# EasyEDA Pro project New Project_2026-09-05_09-11-29.eprj, schematic Schematic3

## Sheets
1 主板: Board Name: 主板; Create Date: 2026-09-05; Page Name: 主板; Project Name: New Project_2026-09-05_09-11-29; Schematic Name: Schematic3; Update Date: 2026-09-07; Company: 嘉立创EDA; Page Size: A4; Version: V1.0
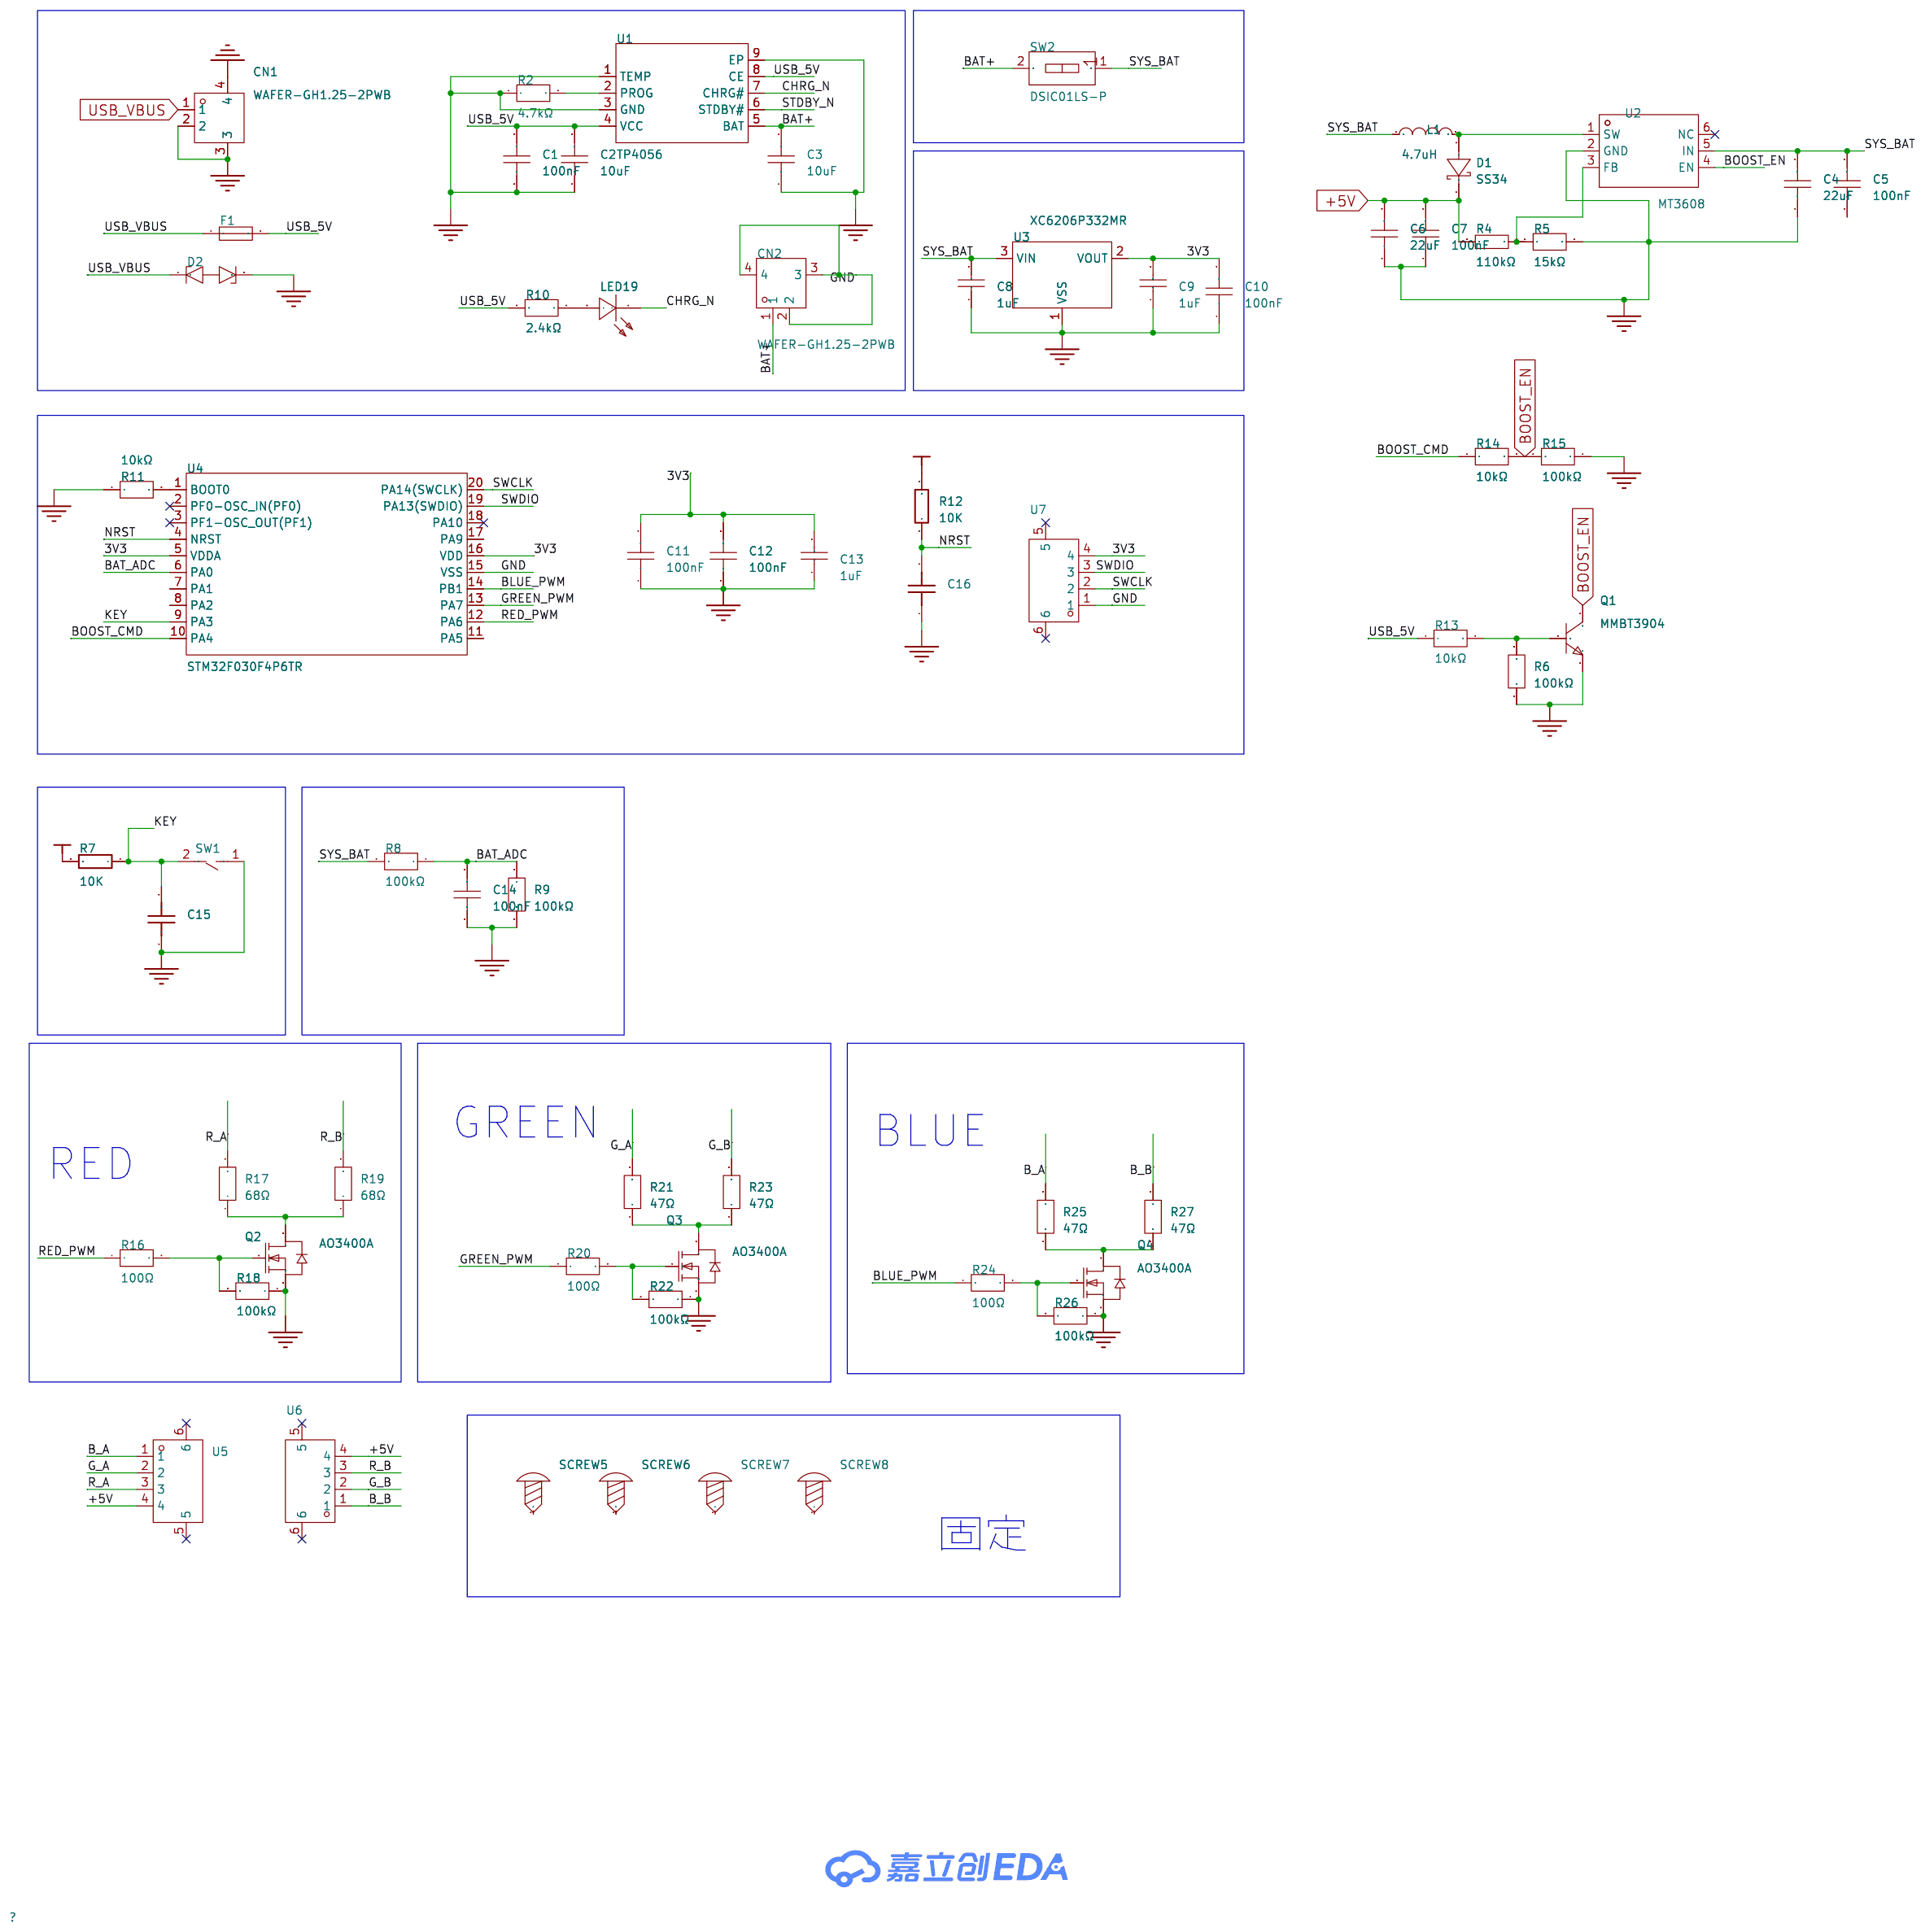
[diagram p1: 主板]
2 灯珠板: Page Name: 灯珠板; Update Date: 2026-09-05
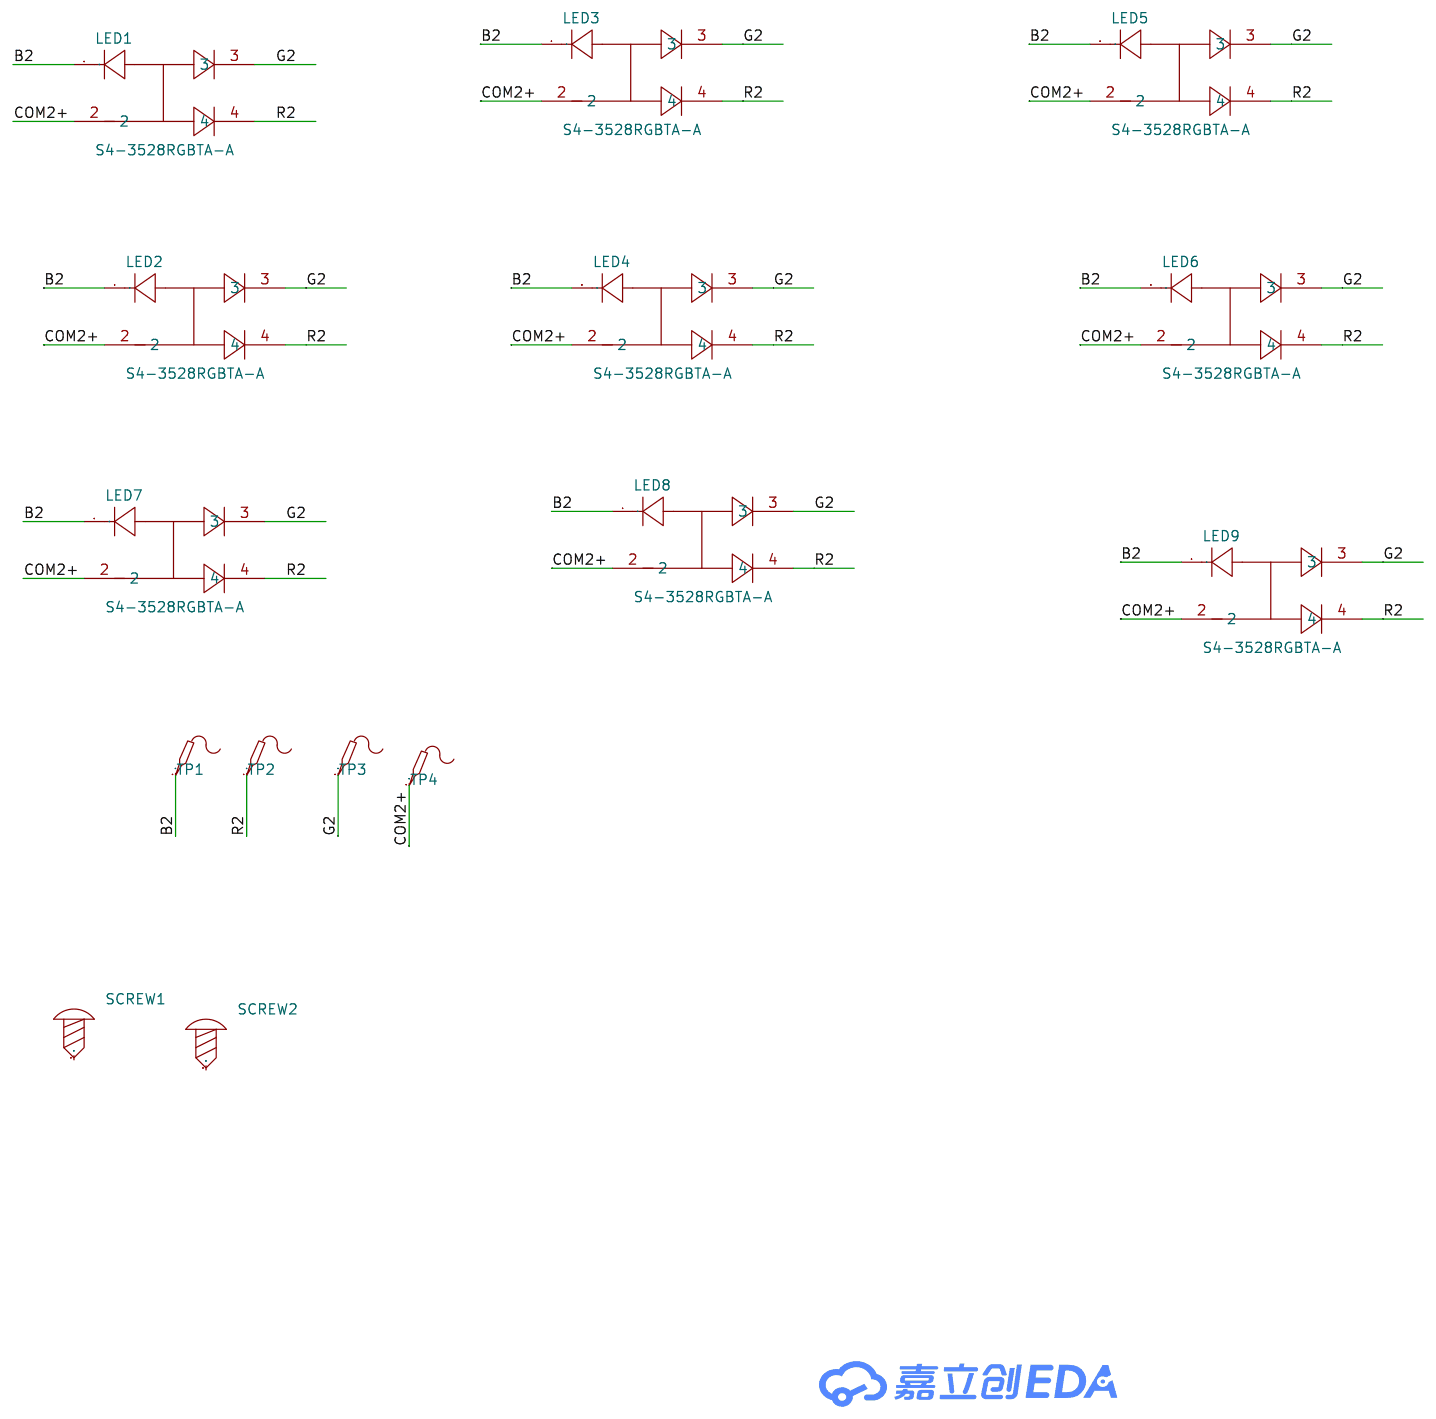
[diagram p2: 灯珠板]
3 灯珠板2: Page Name: 灯珠板2; Update Date: 2026-09-05
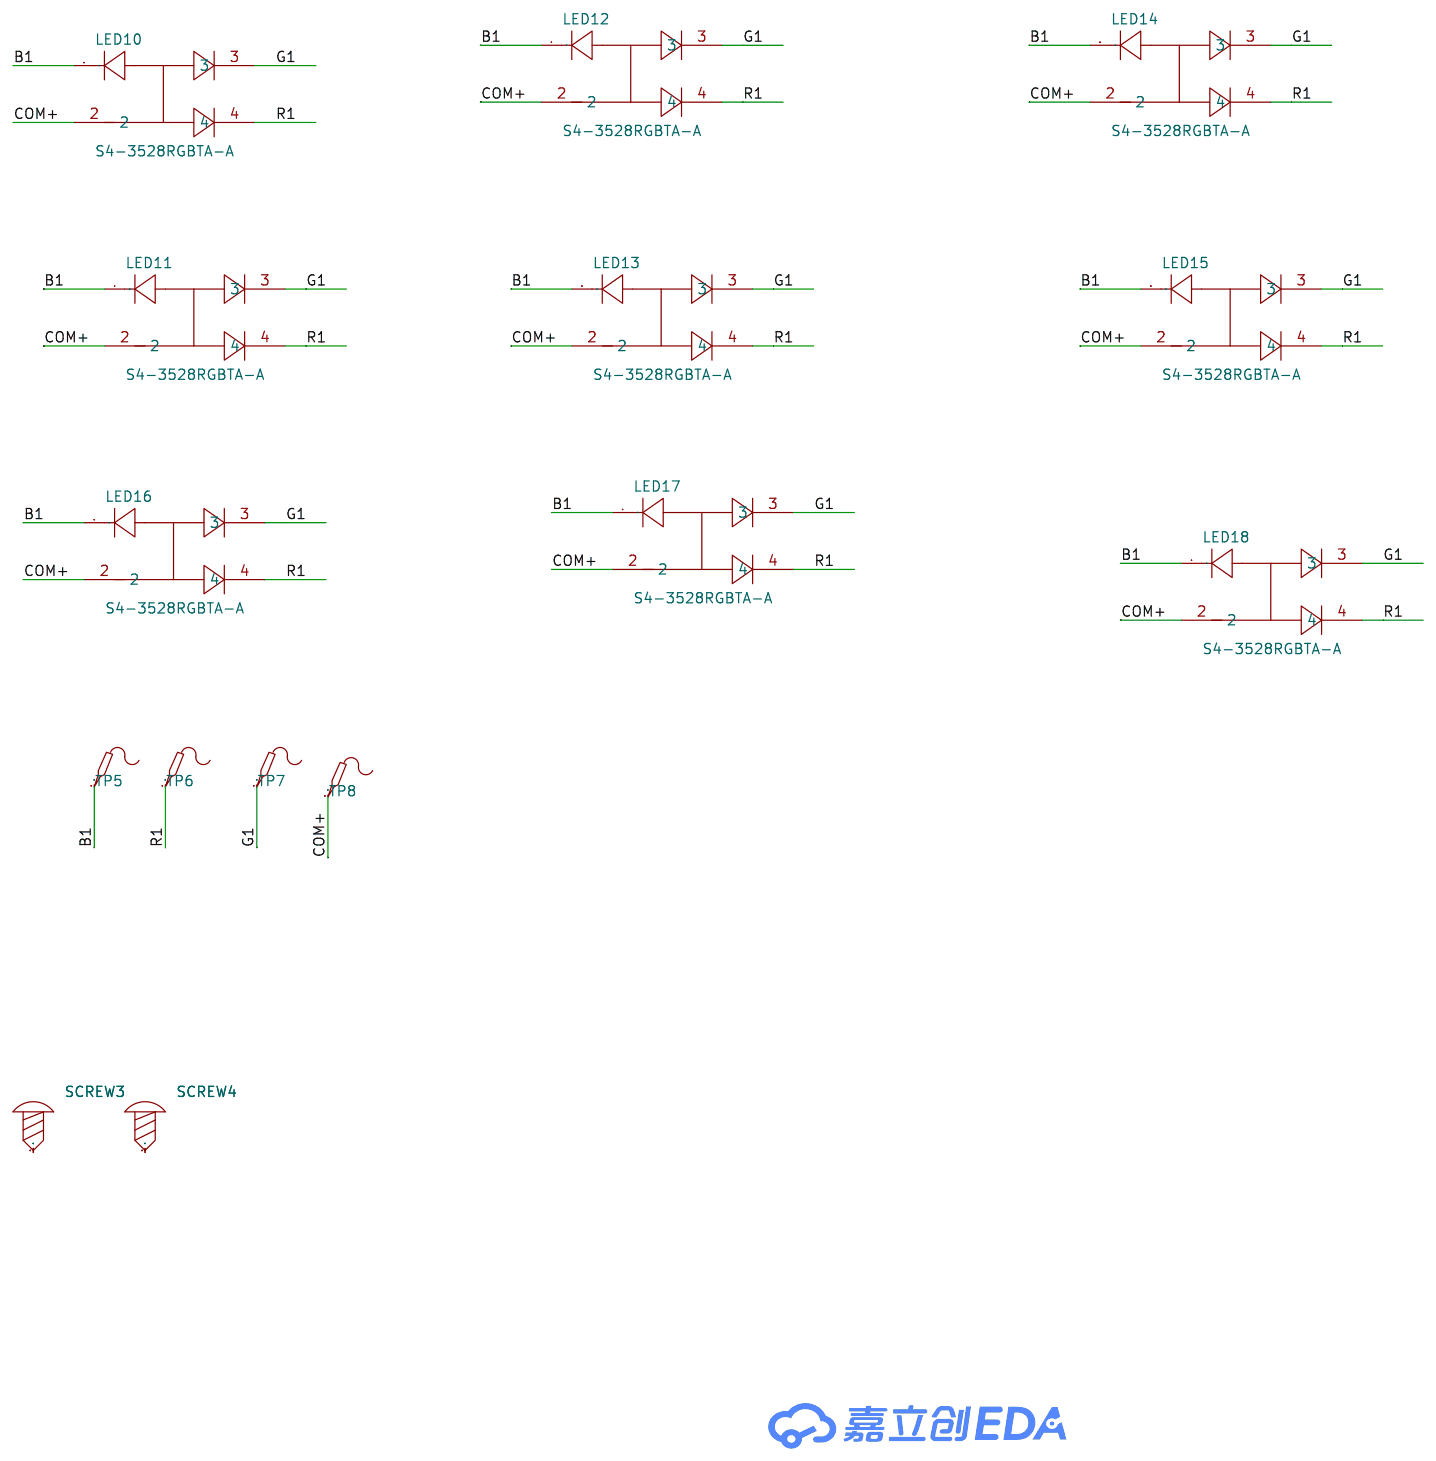
[diagram p3: 灯珠板2]

## Parts
sheet 主板
C1  100nF  [C0603]
C2  10uF  [C1206]
C3  10uF  [C1206]
C4  22uF  [C0805]
C5  100nF  [C0603]
C6  22uF  [C0805]
C7  100nF  [C0603]
C8  1uF  [C0603]
C9  1uF  [C0603]
C10  100nF  [C0603]
C11  100nF  [C0603]
C12  100nF  [C0603]
C13  1uF  [C0603]
C14  100nF  [C0603]
C15  100nF  [C0603]
C16  100nF  [C0603]
CN1  WAFER-GH1.25-2PWB  [CONN-TH_2P-P1.25_XUNPU_WAFER-GH1.25-2PWB]
CN2  WAFER-GH1.25-2PWB  [CONN-TH_2P-P1.25_XUNPU_WAFER-GH1.25-2PWB]
D1  SS34  [SMA_L4.3-W2.6-LS5.0-FD]
D2  PESD5V0S1BA,115  [SOD-323_L1.7-W1.3-LS2.5-BI]
F1  BSMD1206-200-6V  [F1206]
L1  4.7uH  [IND-SMD_L4.6-W4.1-A]
LED19  LTST-C190KSKT  [LED0603-RD]
Q1  MMBT3904  [SOT-23-3_L2.9-W1.3-P1.90-LS2.4-BR]
Q2  AO3400A  [SOT-23-3_L2.9-W1.3-P1.90-LS2.4-BR]
Q3  AO3400A  [SOT-23-3_L2.9-W1.3-P1.90-LS2.4-BR]
Q4  AO3400A  [SOT-23-3_L2.9-W1.3-P1.90-LS2.4-BR]
R2  4.7kΩ  [R0603]
R4  110kΩ  [R0603]
R5  15kΩ  [R0603]
R6  100kΩ  [R0603]
R7  10K  [R0603]
R8  100kΩ  [R0603]
R9  100kΩ  [R0603]
R10  2.4kΩ  [R0603]
R11  10kΩ  [R0603]
R12  10K  [R0603]
R13  10kΩ  [R0603]
R14  10kΩ  [R0603]
R15  100kΩ  [R0603]
R16  100Ω  [R0603]
R17  68Ω  [R1210]
R18  100kΩ  [R0603]
R19  68Ω  [R1210]
R20  100Ω  [R0603]
R21  47Ω  [R1210]
R22  100kΩ  [R0603]
R23  47Ω  [R1210]
R24  100Ω  [R0603]
R25  47Ω  [R1210]
R26  100kΩ  [R0603]
R27  47Ω  [R1210]
SCREW5  -  [M2螺丝]
SCREW6  -  [M2螺丝]
SCREW7  -  [M2螺丝]
SCREW8  -  [M2螺丝]
SW1  TSX06121-095B333DA-L2000  [SW-TH_L6.1-W6.1-P5.00]
SW2  DSIC01LS-P  [SW-SMD_2P-L3.5-W6.1-P2.54-LS9.8]
U1  TP4056  [ESOP-8_L4.9-W3.9-P1.27-LS6.0-BL-EP]
U2  MT3608  [SOT-23-6_L2.9-W1.6-P0.95-LS2.8-BL]
U3  XC6206P332MR  [SOT-23-3_L2.9-W1.3-P1.90-LS2.4-BR]
U4  STM32F030F4P6TR  [SOP-20_L6.5-W4.4-P0.65-LS6.4-BL]
U5  WAFER-GH1.25-4PWB  [CONN-SMD_4P-P1.25_XUNPU_WAFER-GH1.25-4PWB]
U6  WAFER-GH1.25-4PWB  [CONN-SMD_4P-P1.25_XUNPU_WAFER-GH1.25-4PWB]
U7  WAFER-GH1.25-4PWB  [CONN-SMD_4P-P1.25_XUNPU_WAFER-GH1.25-4PWB]
sheet 灯珠板2
LED10  S4-3528RGBTA-A  [LED-SMD_4P-L3.2-W2.8-LS3.5-TL-1]
LED11  S4-3528RGBTA-A  [LED-SMD_4P-L3.2-W2.8-LS3.5-TL-1]
LED12  S4-3528RGBTA-A  [LED-SMD_4P-L3.2-W2.8-LS3.5-TL-1]
LED13  S4-3528RGBTA-A  [LED-SMD_4P-L3.2-W2.8-LS3.5-TL-1]
LED14  S4-3528RGBTA-A  [LED-SMD_4P-L3.2-W2.8-LS3.5-TL-1]
LED15  S4-3528RGBTA-A  [LED-SMD_4P-L3.2-W2.8-LS3.5-TL-1]
LED16  S4-3528RGBTA-A  [LED-SMD_4P-L3.2-W2.8-LS3.5-TL-1]
LED17  S4-3528RGBTA-A  [LED-SMD_4P-L3.2-W2.8-LS3.5-TL-1]
LED18  S4-3528RGBTA-A  [LED-SMD_4P-L3.2-W2.8-LS3.5-TL-1]
SCREW3  -  [M2螺丝]
SCREW4  -  [M2螺丝]
TP5  -  [Test-Point-0.5mm]
TP6  -  [Test-Point-0.5mm]
TP7  -  [Test-Point-0.5mm]
TP8  -  [Test-Point-0.5mm]
sheet 灯珠板
LED1  S4-3528RGBTA-A  [LED-SMD_4P-L3.2-W2.8-LS3.5-TL-1]
LED2  S4-3528RGBTA-A  [LED-SMD_4P-L3.2-W2.8-LS3.5-TL-1]
LED3  S4-3528RGBTA-A  [LED-SMD_4P-L3.2-W2.8-LS3.5-TL-1]
LED4  S4-3528RGBTA-A  [LED-SMD_4P-L3.2-W2.8-LS3.5-TL-1]
LED5  S4-3528RGBTA-A  [LED-SMD_4P-L3.2-W2.8-LS3.5-TL-1]
LED6  S4-3528RGBTA-A  [LED-SMD_4P-L3.2-W2.8-LS3.5-TL-1]
LED7  S4-3528RGBTA-A  [LED-SMD_4P-L3.2-W2.8-LS3.5-TL-1]
LED8  S4-3528RGBTA-A  [LED-SMD_4P-L3.2-W2.8-LS3.5-TL-1]
LED9  S4-3528RGBTA-A  [LED-SMD_4P-L3.2-W2.8-LS3.5-TL-1]
SCREW1  -  [M2螺丝]
SCREW2  -  [M2螺丝]
TP1  -  [Test-Point-0.5mm]
TP2  -  [Test-Point-0.5mm]
TP3  -  [Test-Point-0.5mm]
TP4  -  [Test-Point-0.5mm]

## Library data of the parts
C1 C5 C7 C10-C12 C14 = FCC0603B104K500CT: LCSC Part Name: 100nF ±10% 50V; Supplier Part: C5137636; Manufacturer: FOJAN(富捷); Supplier Footprint: 0603; JLCPCB Part Class: 扩展库; Datasheet: https://item.szlcsc.com/datasheet/FCC0603B104K500CT/5747088.html; Supplier: LCSC; Tolerance: ±10%; Voltage Rating: 50V; Temperature Coefficient: X7R; Operating Temperature: -55℃~+125℃; supplier: LCSC; supplierId: C5137636
C2 C3 = HGC1206R5106K500NSPJ: LCSC Part Name: 10uF ±10% 50V; Supplier Part: C7432781; Manufacturer: Chinocera(华瓷); Supplier Footprint: 1206; JLCPCB Part Class: 扩展库; Datasheet: https://item.szlcsc.com/datasheet/HGC1206R5106K500NSPJ/8438263.html; Supplier: LCSC; Tolerance: ±10%; Voltage Rating: 50V; Temperature Coefficient: X5R; supplier: LCSC; supplierId: C7432781
C4 C6 = CGA0805X5R226M250MT: LCSC Part Name: 22uF ±20% 25V; Supplier Part: C6119899; Manufacturer: HRE(芯声); Supplier Footprint: 0805; JLCPCB Part Class: 扩展库; Datasheet: https://item.szlcsc.com/datasheet/CGA0805X5R226M250MT/7062605.html; Supplier: LCSC; Tolerance: ±20%; Voltage Rating: 25V; Temperature Coefficient: X5R; supplier: LCSC; supplierId: C6119899
C8 C9 C13 = CC0603KRX5R8BB105: LCSC Part Name: 1uF ±10% 25V; Supplier Part: C14664; Manufacturer: YAGEO(国巨); Supplier Footprint: 0603; JLCPCB Part Class: 扩展库; Datasheet: https://item.szlcsc.com/datasheet/CC0603KRX5R8BB105/15332.html; Supplier: LCSC; Tolerance: ±10%; Voltage Rating: 25V; Temperature Coefficient: X5R; supplier: LCSC; supplierId: C14664
C15 C16 = CAP_0603: Supplier Footprint: 0603
CN1 CN2 = WAFER-GH1.25-2PWB: LCSC Part Name: 1x2P 间距:1.25mm 卧贴 系列:GH; Supplier Part: C3029377; Manufacturer: XUNPU(讯普); Supplier Footprint: SMD,P=1.25mm,卧贴; JLCPCB Part Class: 扩展库; Datasheet: https://item.szlcsc.com/datasheet/WAFER-GH1.25-2PWB/3561389.html; Supplier: LCSC; Pins Structure: 1x2P; Pitch: 1.25mm; Mounting Type: 卧贴; Reference Series: GH; Number of Pins: 2P; Number of Rows: 1; Number of PINs Per Row: 2; Current Rating: 1A; Contact Material: 黄铜; Contact Plating: 锡; Operating Temperature: -25℃~+85℃; Voltage Rating: 125V; Plastic Material: LCP; Supplementary Features: 辅助焊脚; Color: 米色; Z-Height of the Board: 4.35mm; X-Length of Bottom Edge on Board (Spacing Line): 5.75mm; Y-Width of Bottom Edge on Board: 5mm
D1 = SS34_C7420365: LCSC Part Name: 电压:40V 电流:3A; Supplier Part: C7420365; Manufacturer: R+O(宏嘉诚); Supplier Footprint: SMA(DO-214AC); JLCPCB Part Class: 扩展库; Datasheet: https://item.szlcsc.com/datasheet/SS34/8397187.html; Supplier: LCSC; Diode Configuration: 独立式; Voltage - Forward(Vf@If): 550mV@3A; Voltage - DC Reverse(Vr): 40V; Current - Rectified: 3A; Reverse Leakage Current (Ir): 200uA@40V; supplier: LCSC; supplierId: C7420365
D2 = PESD5V0S1BA,115: LCSC Part Name: 双向ESD 5V截止 峰值浪涌电流：12A@8/20us; Supplier Part: C19224; Manufacturer: Nexperia(安世); Supplier Footprint: SOD-323; JLCPCB Part Class: 扩展库; Datasheet: https://item.szlcsc.com/datasheet/PESD5V0S1BA%252C115/19931.html; Supplier: LCSC; Polarity: 双向; Reverse Stand-Off Voltage (Vrwm): 5V; Clamping Voltage: 14V; Peak Pulse Current (Ipp): 12A@8/20us; Peak Pulse Power Dissipation (Ppp): 130W@8/20us; Voltage - Breakdown: 9.5V; Reverse Leakage Current (Ir): 5nA; Number of Channels: 单路; Operating Temperature: -55℃~+150℃; level of protection: IEC 61000-4-5；IEC 61000-4-2; Type: ESD; Junction Capacitance: 35pF; supplier: LCSC; supplierId: C19224
F1 = BSMD1206-200-6V: LCSC Part Name: 6V 2A 1206自恢复; Supplier Part: C883134; Manufacturer: BHFUSE(佰宏); Supplier Footprint: 1206; JLCPCB Part Class: 扩展库; Datasheet: https://item.szlcsc.com/datasheet/BSMD1206-200-6V/947809.html; Supplier: LCSC; Voltage - Max: 6V; Current - Max: 100A; Hold Current: 2A; Trip Current: 3.5A; Power Dissipation: 1W; Resistance - Initial (Ri) (Min): 15mΩ; Resistance - Post Trip (R1) (Max): 80mΩ; Time to Trip(Max): 1.5s; Operating Temperature: -40℃~+85℃; Length: 3.6mm; Width: 1.9mm; Height: 1.6mm; supplier: LCSC; supplierId: C883134
L1 = SRG0420-4R7-M: LCSC Part Name: 高电流功率电感器，无卤素，金属粉末磁芯，磁屏蔽低电磁干扰，高载流低磁芯损耗，符合RoHS标准; Supplier Part: C53462918; Manufacturer: JIERR(捷而瑞); Supplier Footprint: SMD,4.6x4.1mm; JLCPCB Part Class: 扩展库; Datasheet: https://item.szlcsc.com/datasheet/SRG0420-4R7-M/56628163.html; Supplier: LCSC; Tolerance: ±20%; Current Rating: 3A; Current - Saturation(Isat): 3.5A; DC Resistance(DCR): 105mΩ; Type: 一体成型电感; supplier: LCSC; supplierId: C53462918
LED19 = LTST-C190KSKT: LCSC Part Name: 黄灯; Supplier Part: C125095; Manufacturer: LITEON(光宝); Supplier Footprint: 0603; JLCPCB Part Class: 扩展库; Datasheet: https://item.szlcsc.com/datasheet/LTST-C190KSKT/136371.html; Supplier: LCSC; Illumination Color: 黄色; Voltage - Forward(Vf): 2.1V; Power(Watts): 75mW; Forward Current: 20mA; Wavelength - Dominant: 584.5nm~597nm; Peak Wavelength: 588nm; Diode Configuration: 独立二极管; Lens Color: 无色透明透镜; Luminous Intensity: 104mcd; Viewing Angle: 130°; Operating Temperature: -30℃~+85℃; supplier: LCSC; supplierId: C125095
Q1 = MMBT3904_C7420353: LCSC Part Name: hFE:100-300，丝印:1AM NPN 电流:200mA 电压:40V; Supplier Part: C7420353; Manufacturer: R+O(宏嘉诚); Supplier Footprint: SOT-23; JLCPCB Part Class: 扩展库; Datasheet: https://item.szlcsc.com/datasheet/MMBT3904/8397175.html; Supplier: LCSC; type: NPN; Current - Collector(Ic): 200mA; Collector - Emitter Voltage VCEO: 40V; Pd - Power Dissipation: 200mW; DC Current Gain: 100; Transition frequency(fT): 300MHz; Current - Collector Cutoff: 100nA; Vce Saturation(VCE(sat)): 300mV; Operating Temperature: -55℃~+150℃; Emitter-Base Voltage(Vebo): 6V; Number: 1个NPN; Configuration: 独立式; supplier: LCSC; supplierId: C7420353
Q2-Q4 = AO3400A_C347475: LCSC Part Name: 1个N沟道 耐压:30V 电流:5.8A; Supplier Part: C347475; Manufacturer: UMW(友台半导体); Supplier Footprint: SOT-23; JLCPCB Part Class: 扩展库; Datasheet: https://item.szlcsc.com/datasheet/AO3400A/324135.html; Supplier: LCSC; Number: 1个N沟道; Drain to Source Voltage: 30V; Current - Continuous Drain(Id): 5.8A; RDS(on): 17mΩ@10V; Pd - Power Dissipation: 1.4W; Gate Threshold Voltage (Vgs(th)): 1.1V; Gate Charge(Qg): 9.7nC@4.5V; Input Capacitance(Ciss): 823pF; Reverse Transfer Capacitance (Crss@Vds): 77pF; Operating Temperature: -55℃~+150℃; Output Capacitance(Coss): 99pF; supplier: LCSC; supplierId: C347475
R2 = FRC0603F4701TS: LCSC Part Name: 4.7kΩ ±1% 100mW 厚膜电阻; Supplier Part: C2907034; Manufacturer: FOJAN(富捷); Supplier Footprint: 0603; JLCPCB Part Class: 扩展库; Datasheet: https://item.szlcsc.com/datasheet/FRC0603F4701TS/3180547.html; Supplier: LCSC; Type: 厚膜电阻; Tolerance: ±1%; Power(Watts): 100mW; Voltage-Supply(Max): 75V; Temperature Coefficient: ±100ppm/℃; Operating Temperature: -55℃~+155℃; supplier: LCSC; supplierId: C2907034
R4 = 0603WAF1103T5E: LCSC Part Name: 厚膜电阻 110kΩ ±1%; Supplier Part: C25805; Manufacturer: UNI-ROYAL(厚声); Supplier Footprint: 0603; JLCPCB Part Class: 扩展库; Datasheet: https://item.szlcsc.com/datasheet/0603WAF1103T5E/26548.html; Supplier: LCSC; Type: 厚膜电阻; Tolerance: ±1%; Power(Watts): 100mW; Voltage-Supply(Max): 75V; Temperature Coefficient: ±100ppm/℃; Operating Temperature: -55℃~+155℃; supplier: LCSC; supplierId: C25805
R5 = FRC0603F1502TS: LCSC Part Name: 15kΩ ±1% 100mW 厚膜电阻; Supplier Part: C2906995; Manufacturer: FOJAN(富捷); Supplier Footprint: 0603; JLCPCB Part Class: 扩展库; Supplier: LCSC; Type: 厚膜电阻; Tolerance: ±1%; Power(Watts): 100mW; Voltage-Supply(Max): 75V; Temperature Coefficient: ±100ppm/℃; Operating Temperature: -55℃~+155℃; supplier: LCSC; supplierId: C2906995
R6 R8 R9 R15 R18 R22 R26 = FRC0603F1003TS: LCSC Part Name: 100kΩ ±1% 100mW 厚膜电阻; Supplier Part: C2906980; Manufacturer: FOJAN(富捷); Supplier Footprint: 0603; Datasheet: https://item.szlcsc.com/datasheet/FRC0603F1003TS/3180493.html; Supplier: LCSC; Type: 厚膜电阻; Tolerance: ±1%; Power(Watts): 100mW; Voltage-Supply(Max): 75V; Temperature Coefficient: ±100ppm/℃; Operating Temperature: -55℃~+155℃; supplier: LCSC; supplierId: C2906980
R7 R12 = Res_0603: Supplier Footprint: 0603
R10 = FRC0603F2401TS: LCSC Part Name: 2.4kΩ ±1% 100mW 厚膜电阻; Supplier Part: C2907007; Manufacturer: FOJAN(富捷); Supplier Footprint: 0603; JLCPCB Part Class: 扩展库; Supplier: LCSC; Type: 厚膜电阻; Tolerance: ±1%; Power(Watts): 100mW; Voltage-Supply(Max): 75V; Temperature Coefficient: ±100ppm/℃; Operating Temperature: -55℃~+155℃; supplier: LCSC; supplierId: C2907007
R11 = FRC0603J103 TS: LCSC Part Name: 10kΩ ±5% 100mW 厚膜电阻; Supplier Part: C2930027; Manufacturer: FOJAN(富捷); Supplier Footprint: 0603; Datasheet: https://item.szlcsc.com/datasheet/FRC0603J103%2520TS/3266960.html; Supplier: LCSC; Type: 厚膜电阻; Tolerance: ±5%; Power(Watts): 100mW; Voltage-Supply(Max): 75V; Temperature Coefficient: ±100ppm/℃; Operating Temperature: -55℃~+155℃; supplier: LCSC; supplierId: C2930027
R13 R14 = FRH0603B1002TS: LCSC Part Name: 10kΩ ±0.1% 100mW 厚膜电阻; Supplier Part: C5126214; Manufacturer: FOJAN(富捷); Supplier Footprint: 0603; JLCPCB Part Class: 扩展库; Datasheet: https://item.szlcsc.com/datasheet/FRH0603B1002TS/5726561.html; Supplier: LCSC; Type: 厚膜电阻; Tolerance: ±0.1%; Power(Watts): 100mW; Voltage-Supply(Max): 75V; Temperature Coefficient: ±100ppm/℃; Operating Temperature: -55℃~+155℃; supplier: LCSC; supplierId: C5126214
R16 R20 R24 = FRC0603F1000TS: LCSC Part Name: 100Ω ±1% 100mW 厚膜电阻; Supplier Part: C2906981; Manufacturer: FOJAN(富捷); Supplier Footprint: 0603; JLCPCB Part Class: 扩展库; Datasheet: https://item.szlcsc.com/datasheet/FRC0603F1000TS/3180494.html; Supplier: LCSC; Type: 厚膜电阻; Tolerance: ±1%; Power(Watts): 100mW; Voltage-Supply(Max): 75V; Temperature Coefficient: ±100ppm/℃; Operating Temperature: -55℃~+155℃; supplier: LCSC; supplierId: C2906981
R17 R19 = FRC1210J680TS: LCSC Part Name: 厚膜电阻 68Ω ±5% 500mW; Supplier Part: C2930448; Manufacturer: FOJAN(富捷); Supplier Footprint: 1210; JLCPCB Part Class: 扩展库; Supplier: LCSC; Type: 厚膜电阻; Tolerance: ±5%; Power(Watts): 500mW; Voltage-Supply(Max): 200V; Temperature Coefficient: ±100ppm/℃; Operating Temperature: -55℃~+155℃; supplier: LCSC; supplierId: C2930448
R21 R23 R25 R27 = FRC1210F43R0TS: LCSC Part Name: 厚膜电阻 43Ω ±1% 500mW; Supplier Part: C2999573; Manufacturer: FOJAN(富捷); Supplier Footprint: 1210; JLCPCB Part Class: 扩展库; Datasheet: https://item.szlcsc.com/datasheet/FRC1210F43R0TS/3477013.html; Supplier: LCSC; Type: 厚膜电阻; Tolerance: ±1%; Power(Watts): 500mW; Voltage-Supply(Max): 200V; Temperature Coefficient: ±100ppm/℃; Operating Temperature: -55℃~+155℃; supplier: LCSC
SCREW1-SCREW8 = M2螺丝: Supplier Footprint: 插件
SW1 = TSX06121-095B333DA-L2000: LCSC Part Name: 6*6*9.5长两脚防水轻触开关; Supplier Part: C42435357; Manufacturer: Khon(康宏电子); Supplier Footprint: 插件,6.1x6.1mm; Datasheet: https://item.szlcsc.com/datasheet/TSX06121-095B333DA-L2000/44473186.html; Supplier: LCSC; Circuit: 单刀单掷; Actuator Style: 圆形按钮; Operating Force: 1.8N; Length: 6.1mm; Width: 6.1mm; Switch Height: 9.5mm; with Bracket: 不带支架; Contact Current: 50mA; Voltage Rating: 12V; Actuator/Cap Color: 黑色; With Lamp: 无; Life: 10万次; Operating Temperature: -40℃~85℃; supplier: LCSC; supplierId: C42435357
SW2 = DSIC01LS-P: LCSC Part Name: 平拨,凸起式 1位拨码开关; Supplier Part: C600988; Manufacturer: XKB Connection(中国星坤); Supplier Footprint: SMD; JLCPCB Part Class: 扩展库; Datasheet: https://item.szlcsc.com/datasheet/DSIC01LS-P/631008.html; Supplier: LCSC; Type: 平拨,凸起式; Circuit: 单刀单掷; Number of Positions: 1位; Termination Style: 鸥翼型; Current Rating: 25mA; Voltage Rating: 24V; Operating Temperature: -20℃~+70℃; Operating Life: 3千次; Color: 黑色; supplier: LCSC; supplierId: C600988
U1 = TP4056_C725790: LCSC Part Name: 1A独立式线性锂离子电池充电器; Supplier Part: C725790; Manufacturer: UMW(友台半导体); Supplier Footprint: ESOP-8; JLCPCB Part Class: 扩展库; Datasheet: https://item.szlcsc.com/datasheet/TP4056/772193.html; Supplier: LCSC; The Chip Type: 充电芯片; Voltage - Supply: 4V~6.5V; Charge Current - Max: 1A; Charging Saturation Voltage: 4.2V; Type of Battery: 锂电池; Number of Cells: 1; Operating Temperature: -40℃~+85℃; Battery Temperature Detection: 支持; 0V Battery Charge: 支持; Supply Current (Iq): 35uA; Features: 恒压充电；恒流充电；自动再充电；充电终止；软启动；可编程充电电流；欠压锁定；涓流充电; supplier: LCSC; supplierId: C725790
U2 = MT3608: LCSC Part Name: 老版本 升压型 2A 2V~24V; Supplier Part: C84817; Manufacturer: 西安航天民芯; Supplier Footprint: SOT-23-6; JLCPCB Part Class: 扩展库; Datasheet: https://item.szlcsc.com/datasheet/MT3608/85988.html; Supplier: LCSC; Function: 升压型; Voltage - Supply: 2V~24V; Output Voltage: 600mV~28V; Output Current: 2A; Frequency - Switching: 1.2MHz; Operating Temperature: -40℃~+85℃; Synchronous Rectifier: 否; Number of Outputs: 1; Topology: 升压式; Quiescent Current: 100uA；1.6mA; Switch tube (built-in/external): 内置; Output Type: 可调; Features: 轻载高效模式；过流保护; supplier: LCSC; supplierId: C84817
U3 = XC6206P332MR_C5148692: LCSC Part Name: 3.3V 300mA 8V; Supplier Part: C5148692; Manufacturer: HXY MOSFET(华轩阳电子); Supplier Footprint: SOT-23; JLCPCB Part Class: 扩展库; Datasheet: https://item.szlcsc.com/datasheet/XC6206P332MR/5771929.html; Supplier: LCSC; Output Configuration: 正极; Voltage - Supply: 8V; Output Voltage: 3.3V; Output Current: 300mA; Power Supply Rejection Ratio (PSRR): 40dB@(1kHz); Voltage Dropout: 240mV@(50mA); standby current: 3uA; Features: 过流保护；短路保护; Operating Temperature: -40℃~+85℃@(Ta); Output Type: 固定; Number of Outputs: 1; supplier: LCSC; supplierId: C5148692
U4 = STM32F030F4P6TR: LCSC Part Name: 主流ARM Cortex-M0超值系列MCU，具有16 KB Flash和48 MHz CPU; Supplier Part: C89040; Manufacturer: ST(意法半导体); Supplier Footprint: TSSOP-20; JLCPCB Part Class: 扩展库; Datasheet: https://item.szlcsc.com/datasheet/STM32F030F4P6TR/90220.html; Supplier: LCSC; CPU Core: ARM Cortex-M0; CPU Maximum Speed: 48MHz; Core Size: 32 Bit; Program Storage Size: 16KB; Program Memory Type: FLASH; RAM Size: 4KB; Number of I/O: 15; ADC (Bit): 12bit; Oscillator Type: 内置; Voltage - Supply: 2.4V~3.6V; Operating Temperature: -40℃~+85℃; supplier: LCSC; supplierId: C89040
U5-U7 = WAFER-GH1.25-4PWB: LCSC Part Name: 1x4P 间距:1.25mm 卧贴 系列:GH; Supplier Part: C3029379; Manufacturer: XUNPU(讯普); Supplier Footprint: SMD,P=1.25mm,卧贴; JLCPCB Part Class: 扩展库; Datasheet: https://item.szlcsc.com/datasheet/WAFER-GH1.25-4PWB/3561391.html; Supplier: LCSC; Pins Structure: 1x4P; Pitch: 1.25mm; Mounting Type: 卧贴; Reference Series: GH; Number of Pins: 4P; Number of Rows: 1; Number of PINs Per Row: 4; Current Rating: 1A; Contact Material: 黄铜; Contact Plating: 锡; Operating Temperature: -25℃~+85℃; Voltage Rating: 125V; Plastic Material: LCP; Supplementary Features: 辅助焊脚; Color: 米色; Z-Height of the Board: 4.35mm; X-Length of Bottom Edge on Board (Spacing Line): 8.25mm; Y-Width of Bottom Edge on Board: 5mm; supplier: LCSC; supplierId: C3029379
LED1-LED18 = S4-3528RGBTA-A: LCSC Part Name: RGB三色; Supplier Part: C2827321; Manufacturer: TUOZHAN(拓展光电); Supplier Footprint: SMD3528-4P; JLCPCB Part Class: 扩展库; Datasheet: https://item.szlcsc.com/datasheet/S4-3528RGBTA-A/2972617.html; Supplier: LCSC; Diode Configuration: 共阳极; Dominant Wavelength - R: 617nm~626nm; Dominant Wavelength - G: 518nm~527nm; Dominant Wavelength - B: 461nm~470nm; Viewing Angle: 120°; Lens Color: 无色透明透镜; Antistatic Capacity: B:2000V；G:2000V；R:2500V; Operating Temperature: -40℃~+85℃; Length: 3.5mm; Width: 2.8mm; Height: 1.9mm; Luminous Intensity - R: 460mcd~1000mcd; Luminous Intensity - G: 1300mcd~2900mcd; Luminous Intensity - B: 350mcd~780mcd; Forward Voltage(Vf) - R: 1.8V~2.4V; Forward Voltage(Vf) - G: 2.8V~3.4V; Forward Voltage(Vf) - B: 2.8V~3.4V; Forward Current - R: 20mA; Forward Current - G: 20mA; Forward Current - B: 20mA; Power(Watts) - R: 60mW; Power(Watts) - G: 90mW; Power(Watts) - B: 90mW; supplier: LCSC; supplierId: C2827321
TP1-TP8 = Test-Point

## Nets
3V3: C9.2 C10.2 C11.2 C12.2 C13.2 R7.2 R12.2 U3.2(VOUT) U4.5(VDDA) U4.16(VDD) U7.4
+5V: C6.2 C7.2 D1.2(K) R4.2 U5.4 U6.4
GND: C1.1 C2.1 C3.1 C4.1 C6.1 C7.1 C8.1 C9.1 C10.1 C11.1 C12.1 C13.1 C14.1 C15.1 C16.1 CN1.2 CN1.3 CN1.4 CN2.2 CN2.3 CN2.4 D2.2 Q1.2(E) Q2.2(S) Q3.2(S) Q4.2(S) R2.1 R5.1 R6.1 R9.2 R11.1 R15.1 R18.1 R22.1 R26.1 SW1.1 U1.1(TEMP) U1.3(GND) U1.9(EP) U2.2(GND) U3.1(VSS) U4.15(VSS) U7.1
B1: LED10.1(K) LED11.1(K) LED12.1(K) LED13.1(K) LED14.1(K) LED15.1(K) LED16.1(K) LED17.1(K) LED18.1(K) TP5.1
B2: LED1.1(K) LED2.1(K) LED3.1(K) LED4.1(K) LED5.1(K) LED6.1(K) LED7.1(K) LED8.1(K) LED9.1(K) TP1.1
B_A: R25.2 U5.1
B_B: R27.2 U6.1
BAT+: C3.2 CN2.1 SW2.2(PIN2) U1.5(BAT)
BAT_ADC: C14.2 R8.1 R9.1 U4.6(PA0)
BLUE_PWM: R24.1 U4.14(PB1)
BOOST_CMD: R14.1 U4.10(PA4)
BOOST_EN: Q1.3(C) R14.2 R15.2 U2.4(EN)
CHRG_N: LED19.1(-) U1.7(CHRG#)
COM2+: LED1.2 LED2.2 LED3.2 LED4.2 LED5.2 LED6.2 LED7.2 LED8.2 LED9.2 TP4.1
COM+: LED10.2 LED11.2 LED12.2 LED13.2 LED14.2 LED15.2 LED16.2 LED17.2 LED18.2 TP8.1
G1: LED10.3 LED11.3 LED12.3 LED13.3 LED14.3 LED15.3 LED16.3 LED17.3 LED18.3 TP7.1
G2: LED1.3 LED2.3 LED3.3 LED4.3 LED5.3 LED6.3 LED7.3 LED8.3 LED9.3 TP3.1
G_A: R21.2 U5.2
G_B: R23.2 U6.2
GREEN_PWM: R20.1 U4.13(PA7)
KEY: C15.2 R7.1 SW1.2 U4.9(PA3)
NRST: C16.2 R12.1 U4.4(NRST)
R1: LED10.4 LED11.4 LED12.4 LED13.4 LED14.4 LED15.4 LED16.4 LED17.4 LED18.4 TP6.1
R2: LED1.4 LED2.4 LED3.4 LED4.4 LED5.4 LED6.4 LED7.4 LED8.4 LED9.4 TP2.1
R_A: R17.2 U5.3
R_B: R19.2 U6.3
RED_PWM: R16.1 U4.12(PA6)
STDBY_N: U1.6(STDBY#)
SWCLK: U4.20(PA14(SWCLK)) U7.2
SWDIO: U4.19(PA13(SWDIO)) U7.3
SYS_BAT: C4.2 C5.2 C8.2 L1.1 R8.2 SW2.1(PIN1) U2.5(IN) U3.3(VIN)
USB_5V: C1.2 C2.2 F1.2 R10.2 R13.1 U1.4(VCC) U1.8(CE)
USB_VBUS: CN1.1 D2.1 F1.1
$1N2880: R2.2 U1.2(PROG)
$1N3575: D1.1(A) L1.2 U2.1(SW)
$1N3784: R4.1 R5.2 U2.3(FB)
$1N5380: Q2.1(G) R16.2 R18.2
$1N5670: Q3.1(G) R20.2 R22.2
$1N5839: Q4.1(G) R24.2 R26.2
$1N6844: Q2.3(D) R17.1 R19.1
$1N6957: Q3.3(D) R21.1 R23.1
$1N6996: Q4.3(D) R25.1 R27.1
$1N10532: R11.2 U4.1(BOOT0)
$1N13539: Q1.1(B) R6.2 R13.2
$1N17698: LED19.2(+) R10.1

Not connected (* = marked no-connect by the designer): C5 1; SCREW1 1; SCREW2 1; SCREW3 1; SCREW4 1; SCREW5 1; SCREW6 1; SCREW7 1; SCREW8 1; U2 6(NC)*; U4 2(PF0-OSC_IN(PF0))* 3(PF1-OSC_OUT(PF1))* 7(PA1) 8(PA2) 11(PA5) 17(PA9) 18(PA10)*; U5 5* 6*; U6 5* 6*; U7 5* 6*

## Notes on the sheets
sheet 1
- GREEN
- BLUE
- RED
- 固定
